# Altium schematic sheet cSLIM-SA_display.SchDoc: cSLIM v1 - Display
size A4; SheetNumber: 9; SheetTotal: 12
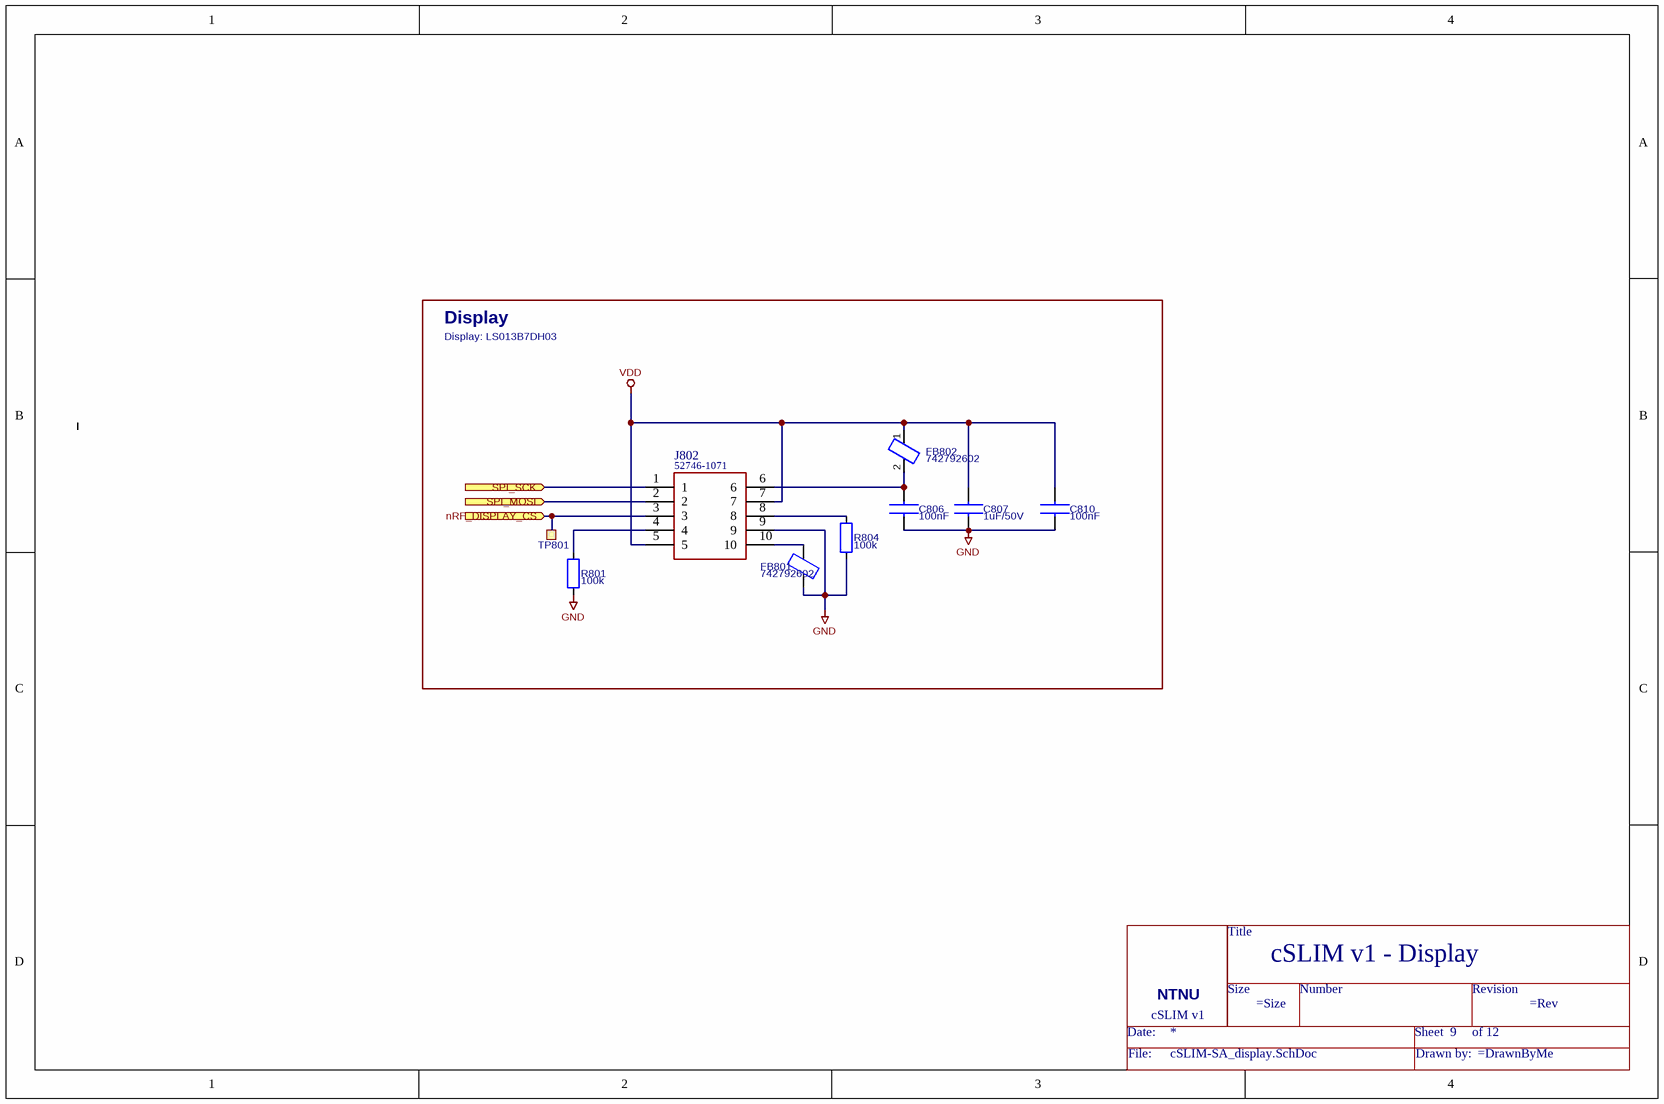
[diagram p0: cSLIM-SA_display.SchDoc]

## Parts
=DocumentName  Title_block  (value not drawn)  (no BOM)
C806  100nF  [CAPC1608X90N]
C807  1uF/50V  [CAPC1608X90N]
C810  100nF  [CAPC1608X90N]
FB801  742792602  [CAPC1608X90N]
FB802  742792602  [CAPC1608X90N]
J802  52746-1071  [52746-1071]
R801  100k  [RESC1608X55N]
R804  100k  [RESC1608X55N]
TP801  TP  [TP_SMD_Ø1.0mm]  (value not drawn)  (no BOM)

## Blocks framed on the sheet
Display: C806 C807 C810 FB801 FB802 J802 R801 R804 TP801

## Ports
nRF_DISPLAY_CS (in), SPI_MOSI (in), SPI_SCK (in)

## Nets
GND: C806.2 C807.2 C810.2 FB801.2 J802.9 R801.2 R804.2
VDD: C807.1 C810.1 FB802.1 J802.5 J802.7
nRF_DISPLAY_CS: J802.3 TP801.1 ; port nRF_DISPLAY_CS
SPI_MOSI: J802.2 ; port SPI_MOSI
SPI_SCK: J802.1 ; port SPI_SCK
NetC806_1: C806.1 FB802.2 J802.6
NetFB801_1: FB801.1 J802.10
NetJ802_4: J802.4 R801.1
NetJ802_8: J802.8 R804.1

## Notes on the sheet
- Display: LS013B7DH03
- 1
- 2
- 3
- 4
- 5
- 6
- A
- B
- C
- Eivind Jølsgard
- D
- Title: cSLIM Display
- File: cSLIM_display.sch
- Sheet: /
- NTNU
- KiCad E.D.A.  kicad (5.1.4)-1
- Size: A4
- Date: 2021-06-30
- Rev: v1.1
- Id: 8/11
- (in symbol Title_block) Title; Size; Number; Revision; NTNU; cSLIM v1; Date:; Sheet; of; File:; Drawn by:

## Library data of the parts
C806 C810 = C: Capacitor; Manufacturer_Part_Number: CL10B104KB8NNNL; Fitted: Yes; value: 100nF
C807 = C: Capacitor; Manufacturer_Part_Number: CL10A105KB8NNNC; Fitted: Yes; value: 1uF/50V
FB801 = Ferrite_Bead: Ferrite bead; value: 60 OHM; Manufacturer_Part_Number: 742792602
FB802 = Ferrite_Bead: value: 60 OHM; Manufacturer_Part_Number: 742792602
J802 = 52746-1071: LCD connector / CONN FFC BOTTOM 10POS 0.50MM R/A; Manufacturer_Name: Molex; Fitted: Yes; Datasheet Link: http://www.molex.com/pdm_docs/sd/527461071_sd.pdf; Manufacturer_Part_Number: 52746-1071; Mouser Part Number: 538-52746-1071; Mouser Price/Stock: https://www.mouser.co.uk/ProductDetail/Molex/52746-1071?qs=gi08C7HaimYPHJccIEZoxg%3D%3D
R801 R804 = R: Manufacturer_Part_Number: RC0603FR-07100KL; Fitted: Yes; value: 100k
TP801 = TP: Test points